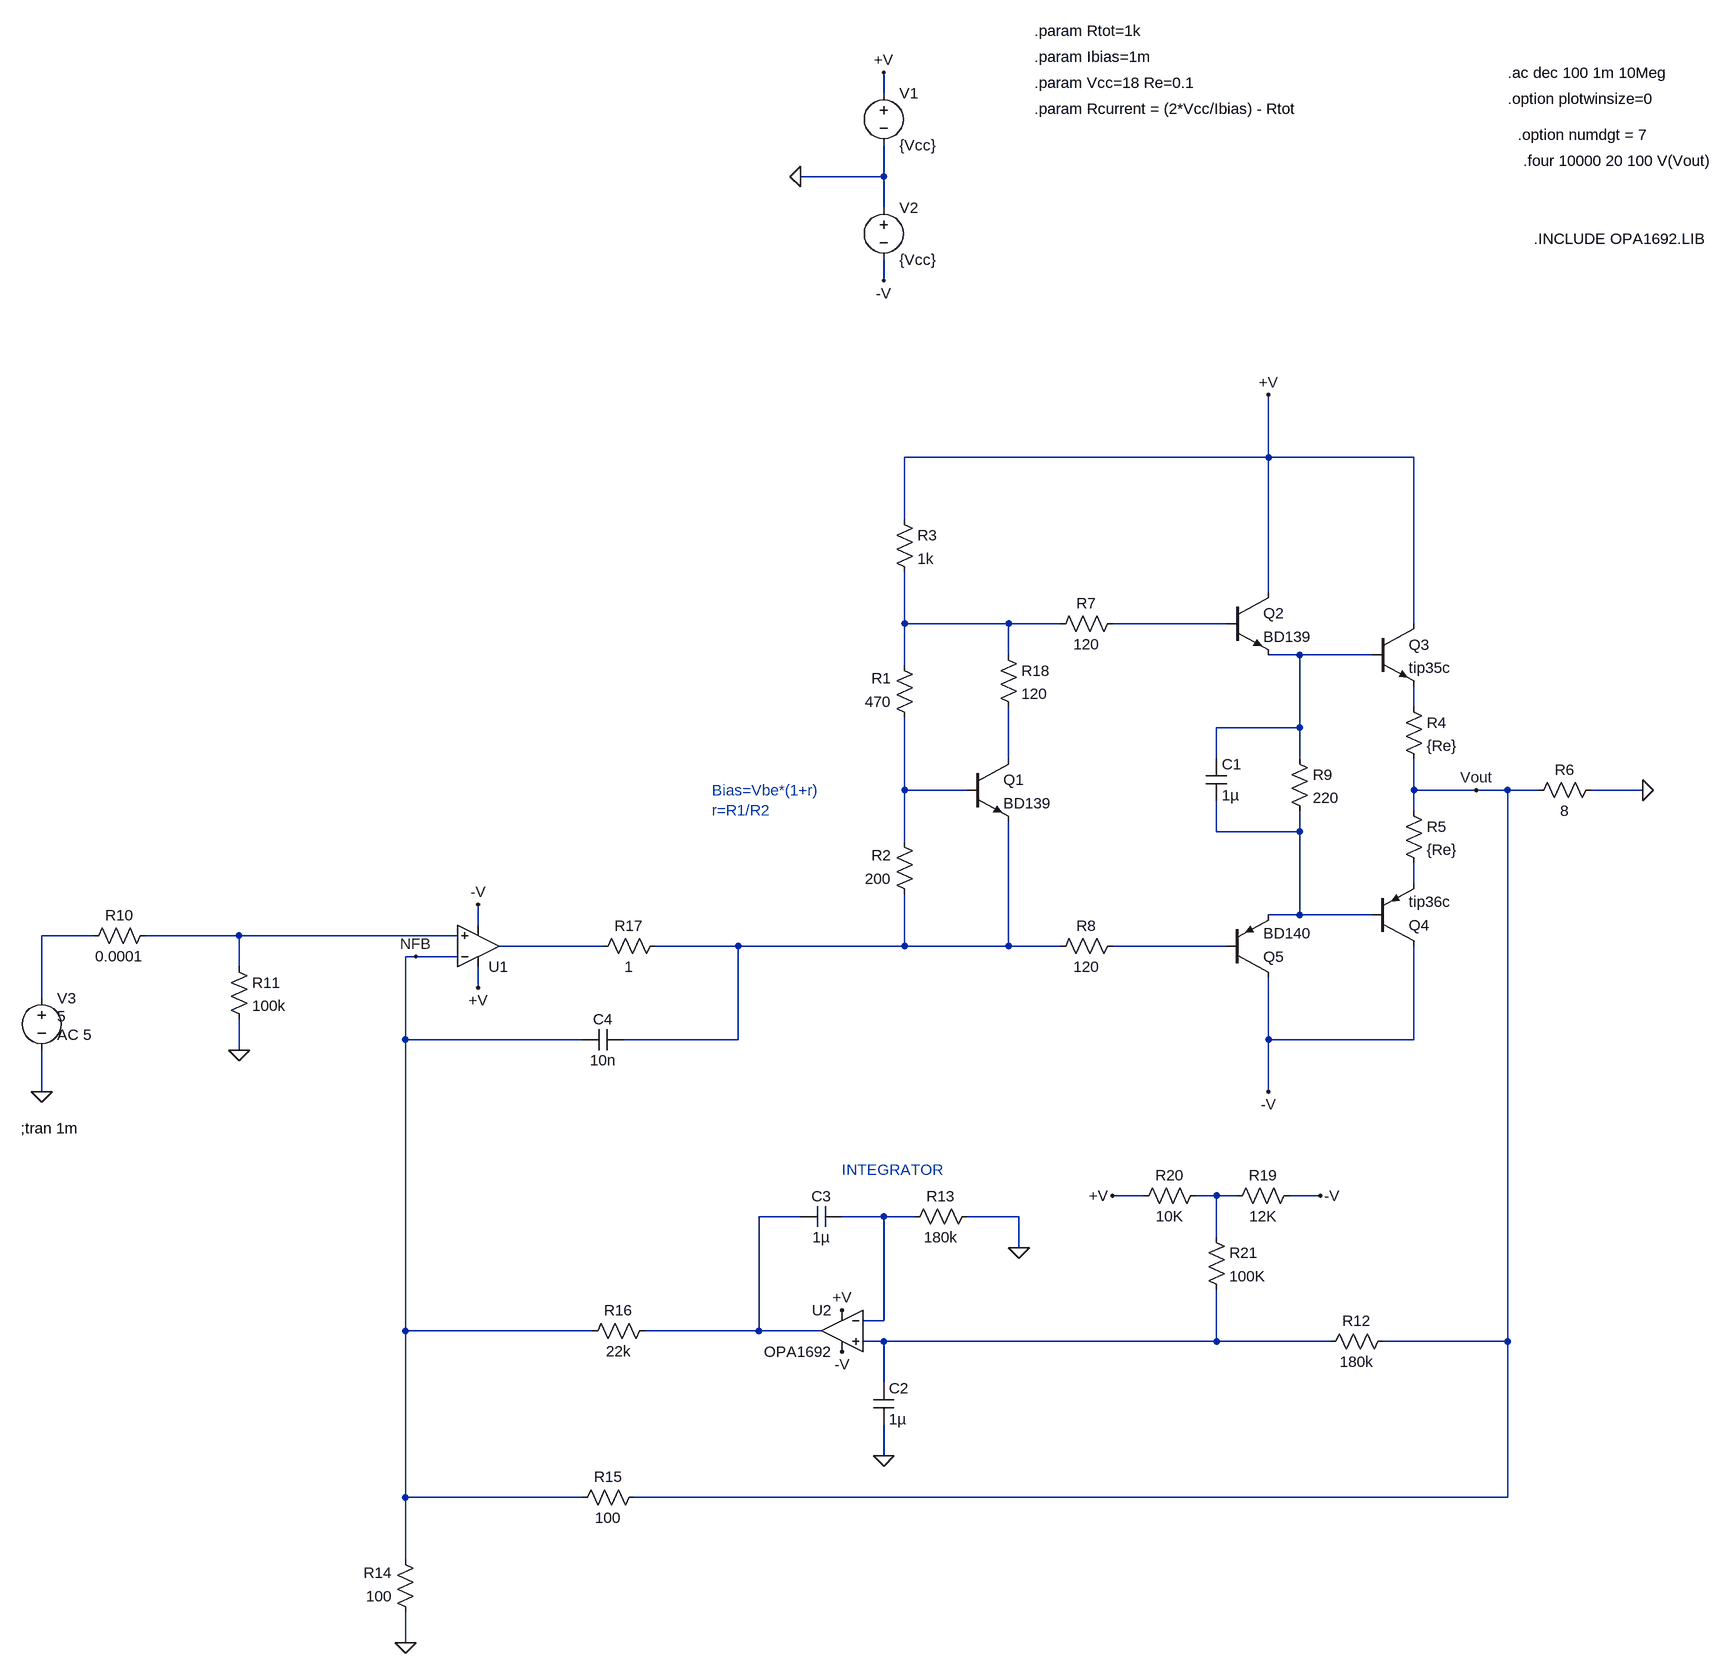
[diagram p0: schematic DC servo - AC.asc]
DC servo - AC.asc, the LTspice schematic file:
Version 4
SHEET 1 880 980
WIRE -544 -1424 -544 -1456
WIRE -544 -1296 -544 -1344
WIRE -544 -1296 -672 -1296
WIRE -544 -1248 -544 -1296
WIRE -544 -1136 -544 -1168
WIRE 48 -864 48 -960
WIRE 48 -864 -512 -864
WIRE 272 -864 48 -864
WIRE -512 -768 -512 -864
WIRE 48 -656 48 -864
WIRE -512 -608 -512 -688
WIRE -352 -608 -512 -608
WIRE -272 -608 -352 -608
WIRE -16 -608 -192 -608
WIRE 272 -608 272 -864
WIRE -352 -560 -352 -608
WIRE 96 -560 48 -560
WIRE 208 -560 96 -560
WIRE -512 -544 -512 -608
WIRE 272 -480 272 -512
WIRE 96 -448 96 -560
WIRE 96 -448 -32 -448
WIRE -352 -400 -352 -480
WIRE -32 -400 -32 -448
WIRE 96 -400 96 -448
WIRE -512 -352 -512 -464
WIRE -416 -352 -512 -352
WIRE 272 -352 272 -400
WIRE 368 -352 272 -352
WIRE 416 -352 368 -352
WIRE 464 -352 416 -352
WIRE 624 -352 544 -352
WIRE 272 -320 272 -352
WIRE -32 -288 -32 -336
WIRE 96 -288 96 -320
WIRE 96 -288 -32 -288
WIRE -512 -272 -512 -352
WIRE 272 -208 272 -240
WIRE 96 -160 96 -288
WIRE 96 -160 48 -160
WIRE 208 -160 96 -160
WIRE -1168 -144 -1168 -176
WIRE -1760 -128 -1840 -128
WIRE -1536 -128 -1680 -128
WIRE -1200 -128 -1536 -128
WIRE -976 -112 -1136 -112
WIRE -768 -112 -896 -112
WIRE -512 -112 -512 -192
WIRE -512 -112 -768 -112
WIRE -352 -112 -352 -304
WIRE -352 -112 -512 -112
WIRE -272 -112 -352 -112
WIRE -16 -112 -192 -112
WIRE -1264 -96 -1280 -96
WIRE -1200 -96 -1264 -96
WIRE -1536 -80 -1536 -128
WIRE -1168 -48 -1168 -80
WIRE -1840 -32 -1840 -128
WIRE -1280 32 -1280 -96
WIRE -1008 32 -1280 32
WIRE -768 32 -768 -112
WIRE -768 32 -944 32
WIRE 48 32 48 -64
WIRE 272 32 272 -112
WIRE 272 32 48 32
WIRE -1536 48 -1536 0
WIRE -1840 112 -1840 48
WIRE 48 112 48 32
WIRE -144 272 -192 272
WIRE -32 272 -64 272
WIRE 0 272 -32 272
WIRE 128 272 80 272
WIRE -672 304 -736 304
WIRE -544 304 -608 304
WIRE -496 304 -544 304
WIRE -336 304 -416 304
WIRE -32 336 -32 272
WIRE -336 352 -336 304
WIRE -544 464 -544 304
WIRE -544 464 -576 464
WIRE -1280 480 -1280 32
WIRE -992 480 -1280 480
WIRE -736 480 -736 304
WIRE -736 480 -912 480
WIRE -640 480 -736 480
WIRE -544 496 -576 496
WIRE -32 496 -32 416
WIRE -32 496 -544 496
WIRE 144 496 -32 496
WIRE 416 496 416 -352
WIRE 416 496 224 496
WIRE -544 560 -544 496
WIRE -544 672 -544 624
WIRE -1280 736 -1280 480
WIRE -1008 736 -1280 736
WIRE 416 736 416 496
WIRE 416 736 -928 736
WIRE -1280 832 -1280 736
WIRE -1280 960 -1280 912
FLAG 48 -960 +V
FLAG 48 112 -V
FLAG -672 -1296 0
FLAG -544 -1456 +V
FLAG -544 -1136 -V
FLAG 624 -352 0
FLAG 368 -352 Vout
FLAG -1840 112 0
FLAG -1168 -48 +V
FLAG -1168 -176 -V
FLAG -1536 48 0
FLAG -608 448 +V
FLAG -608 512 -V
FLAG -544 672 0
FLAG -336 352 0
FLAG -1264 -96 NFB
FLAG -1280 960 0
FLAG -192 272 +V
FLAG 128 272 -V
SYMBOL res -496 -448 R180
WINDOW 0 36 76 Left 2
WINDOW 3 36 40 Left 2
SYMATTR InstName R1
SYMATTR Value 470
SYMBOL res -496 -176 R180
WINDOW 0 36 76 Left 2
WINDOW 3 36 40 Left 2
SYMATTR InstName R2
SYMATTR Value 200
SYMBOL npn -416 -400 R0
SYMATTR InstName Q1
SYMATTR Value BD139
SYMBOL npn -16 -656 R0
SYMATTR InstName Q2
SYMATTR Value BD139
SYMBOL npn 208 -608 R0
SYMATTR InstName Q3
SYMATTR Value tip35c
SYMBOL res -528 -784 R0
SYMATTR InstName R3
SYMATTR Value 1k
SYMBOL pnp 208 -112 M180
SYMATTR InstName Q4
SYMATTR Value tip36c
SYMBOL pnp -16 -64 M180
SYMATTR InstName Q5
SYMATTR Value BD140
SYMBOL res 256 -496 R0
SYMATTR InstName R4
SYMATTR Value {Re}
SYMBOL res 256 -336 R0
SYMATTR InstName R5
SYMATTR Value {Re}
SYMBOL voltage -544 -1440 R0
WINDOW 123 0 0 Left 0
WINDOW 39 0 0 Left 0
SYMATTR InstName V1
SYMATTR Value {Vcc}
SYMBOL voltage -544 -1264 R0
WINDOW 123 0 0 Left 0
WINDOW 39 0 0 Left 0
SYMATTR InstName V2
SYMATTR Value {Vcc}
SYMBOL res 560 -368 R90
WINDOW 0 0 56 VBottom 2
WINDOW 3 32 56 VTop 2
SYMATTR InstName R6
SYMATTR Value 8
SYMBOL res -176 -624 R90
WINDOW 0 0 56 VBottom 2
WINDOW 3 32 56 VTop 2
SYMATTR InstName R7
SYMATTR Value 120
SYMBOL res -176 -128 R90
WINDOW 0 0 56 VBottom 2
WINDOW 3 32 56 VTop 2
SYMATTR InstName R8
SYMATTR Value 120
SYMBOL res 80 -416 R0
SYMATTR InstName R9
SYMATTR Value 220
SYMBOL cap -48 -400 R0
SYMATTR InstName C1
SYMATTR Value 1µ
SYMBOL OpAmps\\opamp2 -1168 -48 M180
WINDOW 3 16 96 Invisible 2
SYMATTR Value OPA1692
SYMATTR InstName U1
SYMBOL voltage -1840 -48 R0
WINDOW 123 24 72 Left 2
WINDOW 39 0 0 Left 0
WINDOW 3 24 44 Left 2
SYMATTR Value2 AC 5
SYMATTR Value 5
SYMATTR InstName V3
SYMBOL res -1664 -144 R90
WINDOW 0 0 56 VBottom 2
WINDOW 3 32 56 VTop 2
SYMATTR InstName R10
SYMATTR Value 0.0001
SYMBOL res -1552 -96 R0
SYMATTR InstName R11
SYMATTR Value 100k
SYMBOL OpAmps\\opamp2 -608 416 M0
SYMATTR InstName U2
SYMATTR Value OPA1692
SYMBOL res 240 480 R90
WINDOW 0 0 56 VBottom 2
WINDOW 3 32 56 VTop 2
SYMATTR InstName R12
SYMATTR Value 180k
SYMBOL cap -560 560 R0
SYMATTR InstName C2
SYMATTR Value 1µ
SYMBOL cap -608 288 R90
WINDOW 0 0 32 VBottom 2
WINDOW 3 32 32 VTop 2
SYMATTR InstName C3
SYMATTR Value 1µ
SYMBOL res -400 288 R90
WINDOW 0 0 56 VBottom 2
WINDOW 3 32 56 VTop 2
SYMATTR InstName R13
SYMATTR Value 180k
SYMBOL res -1264 928 R180
WINDOW 0 36 76 Left 2
WINDOW 3 36 40 Left 2
SYMATTR InstName R14
SYMATTR Value 100
SYMBOL res -912 720 R90
WINDOW 0 0 56 VBottom 2
WINDOW 3 32 56 VTop 2
SYMATTR InstName R15
SYMATTR Value 100
SYMBOL res -896 464 R90
WINDOW 0 0 56 VBottom 2
WINDOW 3 32 56 VTop 2
SYMATTR InstName R16
SYMATTR Value 22k
SYMBOL res -880 -128 R90
WINDOW 0 0 56 VBottom 2
WINDOW 3 32 56 VTop 2
SYMATTR InstName R17
SYMATTR Value 1
SYMBOL res -368 -576 R0
SYMATTR InstName R18
SYMATTR Value 120
SYMBOL res 96 256 R90
WINDOW 0 0 56 VBottom 2
WINDOW 3 32 56 VTop 2
SYMATTR InstName R19
SYMATTR Value 12K
SYMBOL res -48 256 R90
WINDOW 0 0 56 VBottom 2
WINDOW 3 32 56 VTop 2
SYMATTR InstName R20
SYMATTR Value 10K
SYMBOL res -48 320 R0
SYMATTR InstName R21
SYMATTR Value 100K
SYMBOL cap -944 16 R90
WINDOW 0 0 32 VBottom 2
WINDOW 3 32 32 VTop 2
SYMATTR InstName C4
SYMATTR Value 10n
TEXT -808 -352 Left 2 ;Bias=Vbe*(1+r)\nr=R1/R2
TEXT -312 -1520 Left 2 !.param Rtot=1k
TEXT -312 -1480 Left 2 !.param Ibias=1m
TEXT -312 -1440 Left 2 !.param Vcc=18 Re=0.1
TEXT -312 -1400 Left 2 !.param Rcurrent = (2*Vcc/Ibias) - Rtot
TEXT 416 -1456 Left 2 !.ac dec 100 1m 10Meg
TEXT 416 -1416 Left 2 !.option plotwinsize=0
TEXT 432 -1360 Left 2 !.option numdgt = 7
TEXT 440 -1320 Left 2 !.four 10000 20 100 V(Vout)
TEXT 456 -1200 Left 2 !.INCLUDE OPA1692.LIB
TEXT -1872 168 Left 2 !;tran 1m
TEXT -608 232 Left 2 ;INTEGRATOR

The netlist it stands for:
* DC servo - AC.asc
R1 N006 N001 470
R2 N012 N006 200
Q1 N005 N006 N012 0 BD139
Q2 +V N002 N003 0 BD139
Q3 +V N003 N004 0 tip35c
R3 +V N001 1k
Q4 -V N007 N008 0 tip36c
Q5 -V N013 N007 0 BD140
R4 N004 Vout {Re}
R5 Vout N008 {Re}
V1 +V 0 {Vcc}
V2 0 -V {Vcc}
R6 0 Vout 8
R7 N002 N001 120
R8 N013 N012 120
R9 N003 N007 220
C1 N003 N007 1µ
XU1 N010 NFB +V -V N011 OPA1692  ; pins In+ In- V+ V- OUT
V3 N009 0 5 AC 5
R10 N010 N009 0.0001
R11 N010 0 100k
XU2 N017 N016 +V -V N015 OPA1692  ; pins In+ In- V+ V- OUT
R12 Vout N017 180k
C2 N017 0 1µ
C3 N016 N015 1µ
R13 0 N016 180k
R14 0 NFB 100
R15 Vout NFB 100
R16 N015 NFB 22k
R17 N012 N011 1
R18 N001 N005 120
R19 -V N014 12K
R20 N014 +V 10K
R21 N014 N017 100K
C4 N012 NFB 10n
.model NPN NPN
.model PNP PNP
.lib standard.bjt
* Bias=Vbe*(1+r)
* r=R1/R2
.param Rtot=1k
.param Ibias=1m
.param Vcc=18 Re=0.1
.param Rcurrent = (2*Vcc/Ibias) - Rtot
.ac dec 100 1m 10Meg
.option plotwinsize=0
.option numdgt = 7
.four 10000 20 100 V(Vout)
.INCLUDE OPA1692.LIB
;tran 1m
* INTEGRATOR
.backanno
.end